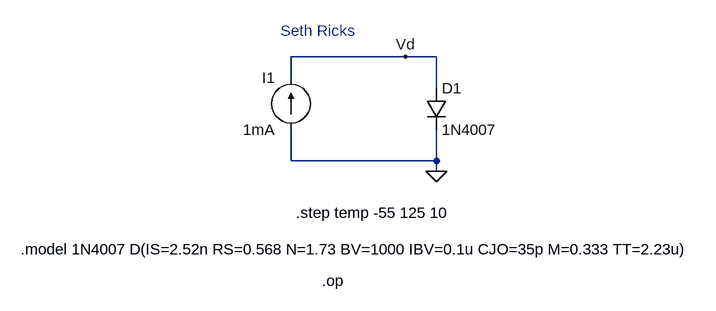
[diagram p0: schematic pn_Junction_Diodes_HW.asc]
pn_Junction_Diodes_HW.asc, the LTspice schematic file:
Version 4
SHEET 1 880 680
WIRE 224 96 48 96
WIRE 272 96 224 96
WIRE 48 128 48 96
WIRE 272 144 272 96
WIRE 48 256 48 208
WIRE 272 256 272 208
WIRE 272 256 48 256
WIRE 272 272 272 256
FLAG 272 272 0
FLAG 224 96 Vd
SYMBOL diode 256 144 R0
SYMATTR InstName D1
SYMATTR Value 1N4007
SYMBOL current 48 208 R180
WINDOW 0 24 80 Left 2
WINDOW 3 24 0 Left 2
WINDOW 123 0 0 Left 0
WINDOW 39 0 0 Left 0
SYMATTR InstName I1
SYMATTR Value 1mA
TEXT 56 336 Left 2 !.step temp -55 125 10
TEXT 32 56 Left 2 ;Seth Ricks
TEXT -368 392 Left 2 !.model 1N4007 D(IS=2.52n RS=0.568 N=1.73 BV=1000 IBV=0.1u CJO=35p M=0.333 TT=2.23u)
TEXT 96 440 Left 2 !.op

The netlist it stands for:
* pn_Junction_Diodes_HW.asc
D1 Vd 0 1N4007
I1 0 Vd 1mA
.model D D
.lib standard.dio
.step temp -55 125 10
* Seth Ricks
.model 1N4007 D(IS=2.52n RS=0.568 N=1.73 BV=1000 IBV=0.1u CJO=35p M=0.333 TT=2.23u)
.op
.backanno
.end

* Results of the author's LTspice run, read from the files saved beside the schematic
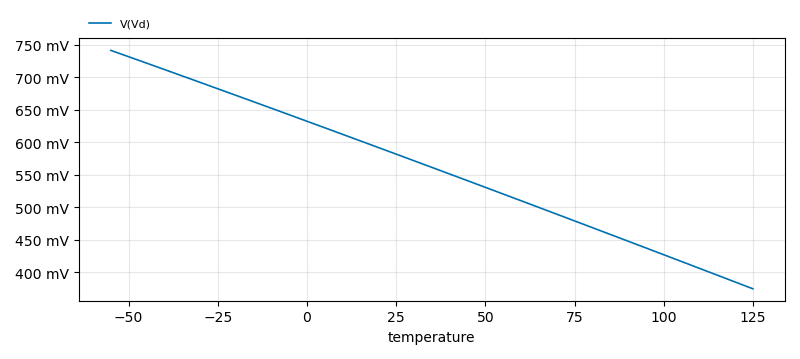
[diagram p1: Operating Point of pn_Junction_Diodes_HW.asc, plotted from the saved traces]
* Operating Point, 1 run:
*   V(Vd): 741.1 mV at temperature=-55 , 374.4 mV at temperature=125 , min 374.4 mV, max 741.1 mV
* From the log:
*   Semiconductor Device Operating Points:
*                           --- Diodes ---
*   Name:      d1
*   Model:   1n4007
*   Id:      1.00e-03
*   Vd:      7.41e-01
*   Req:     3.25e+01
*   CAP:     6.86e-08